# EAGLE design bare_bones_arduino (EAGLE 7.2.0)
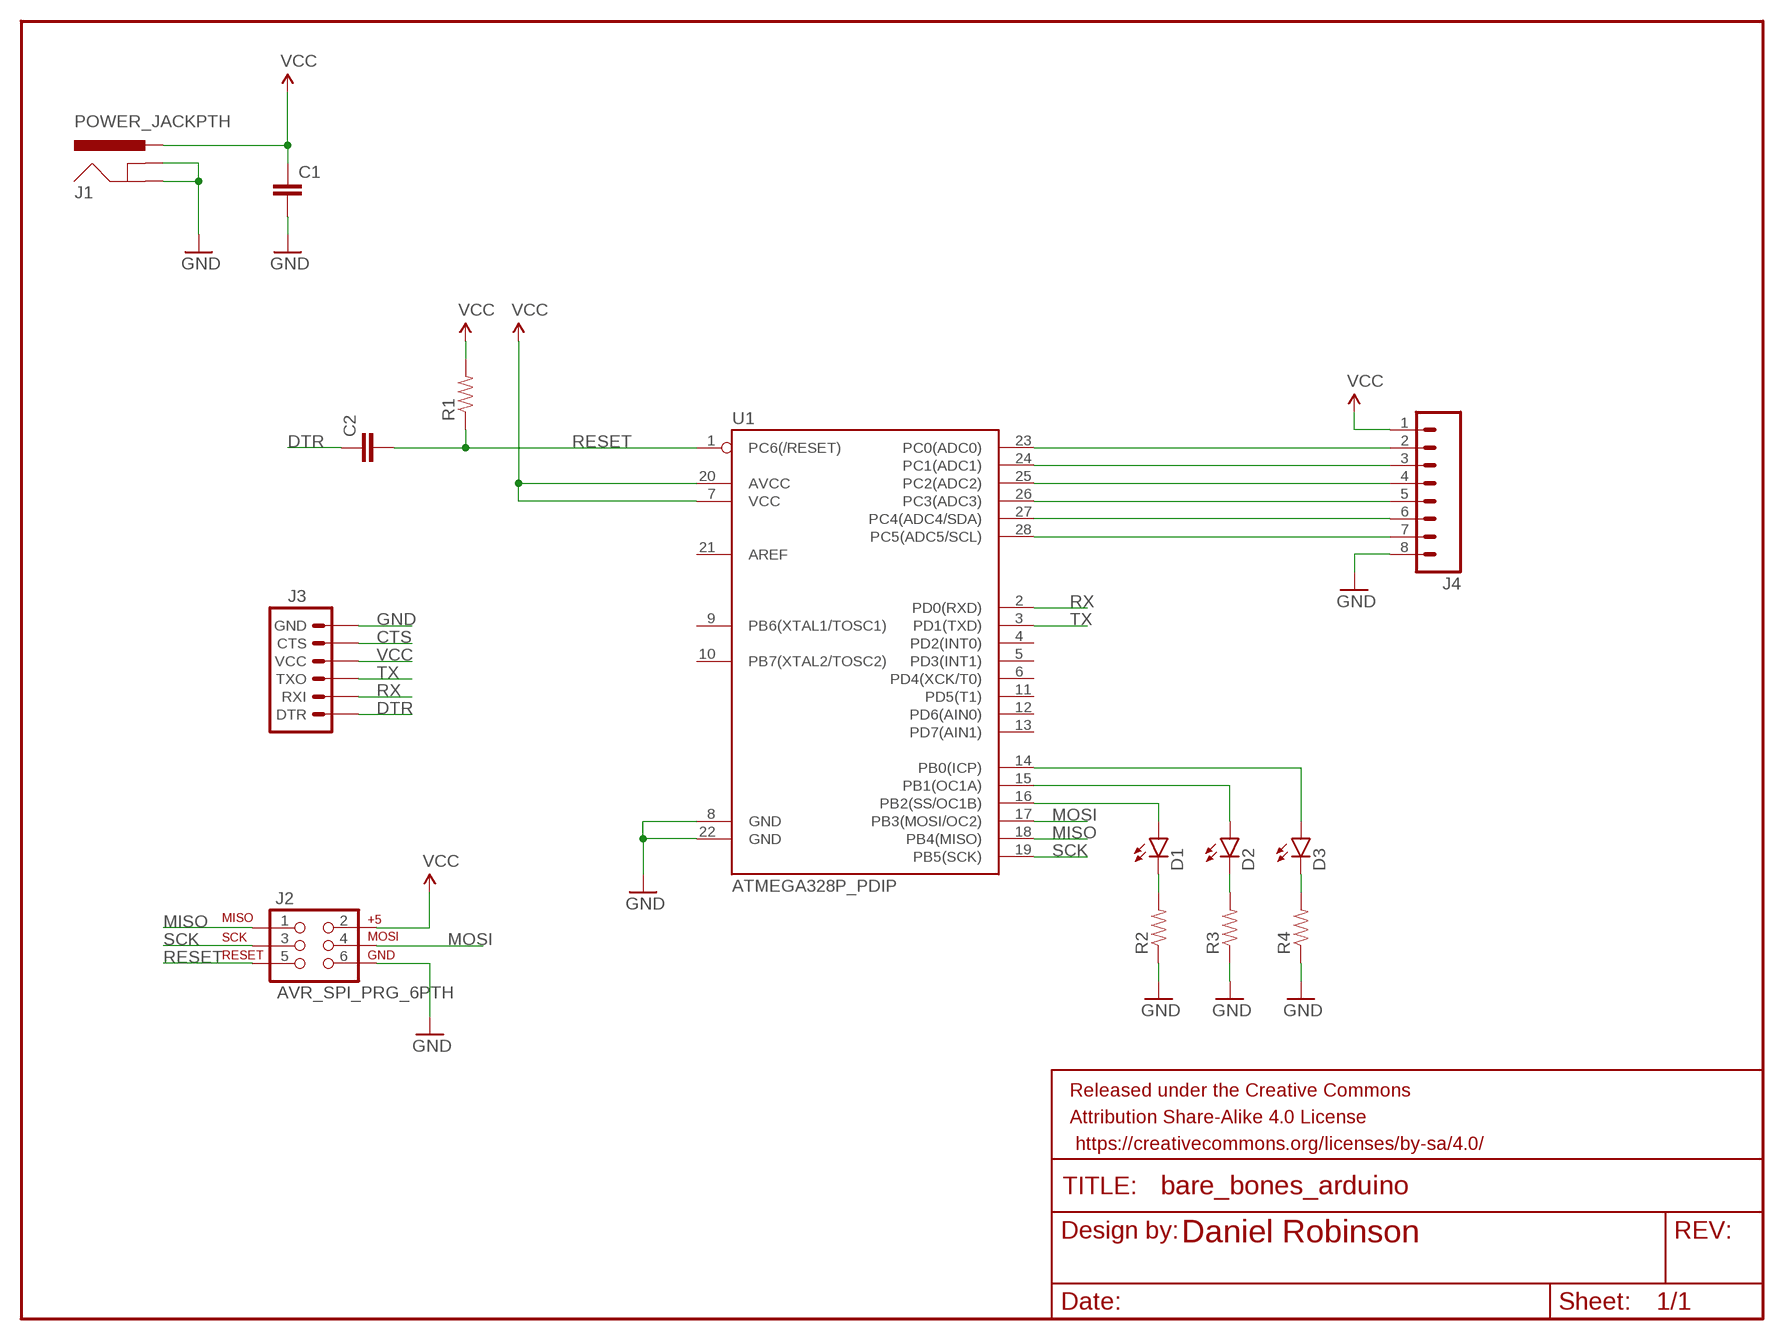
[diagram p0: schematic, sheet 1]

## Parts
C1  CAPPTH  [CAP-PTH-SMALL]
C2  CAPPTH  [CAP-PTH-SMALL]
D1  LED5MM  [LED5MM]
D2  LED5MM  [LED5MM]
D3  LED5MM  [LED5MM]
FRAME1  FRAME-LETTER  [CREATIVE_COMMONS]
J1  POWER_JACKPTH  [POWER_JACK_PTH]
J2  AVR_SPI_PRG_6PTH  [2X3]
J3  ARDUINO_SERIAL_PROGRAMPTH  [1X06]
J4  M08SILK_FEMALE_PTH  [1X08]
R1  RESISTORPTH-1/4W  [AXIAL-0.4]
R2  RESISTORPTH-1/4W  [AXIAL-0.4]
R3  RESISTORPTH-1/4W  [AXIAL-0.4]
R4  RESISTORPTH-1/4W  [AXIAL-0.4]
U1  ATMEGA328P_PDIP  [DIL28-3]

## Nets
CTS: J3.5(CTS)
DTR: C2.1 J3.1(DTR)
GND: C1.2 J1.GND J1.GNDBREAK J2.6 J3.6(GND) J4.8 R2.P$1 R3.P$1 R4.P$1 U1.8(GND) U1.22(GND)
MISO: J2.1 U1.18(PB4(MISO))
MOSI: J2.4 U1.17(PB3(MOSI/OC2))
N$1: J4.2 U1.23(PC0(ADC0))
N$3: J4.5 U1.26(PC3(ADC3))
N$4: J4.6 U1.27(PC4(ADC4/SDA))
N$5: J4.3 U1.24(PC1(ADC1))
N$6: J4.4 U1.25(PC2(ADC2))
N$7: J4.7 U1.28(PC5(ADC5/SCL))
N$9: D1.A U1.16(PB2(SS/OC1B))
N$10: D1.K(C) R2.P$2
N$11: D2.K(C) R3.P$2
N$12: D2.A U1.15(PB1(OC1A))
N$13: D3.A U1.14(PB0(ICP))
N$14: D3.K(C) R4.P$2
RESET: C2.2 J2.5 R1.P$1 U1.1(PC6(/RESET))
RX: J3.2(RXI) U1.2(PD0(RXD))
SCK: J2.3 U1.19(PB5(SCK))
TX: J3.3(TXO) U1.3(PD1(TXD))
VCC: C1.1 J1.PWR J2.2 J3.4(VCC) J4.1 R1.P$2 U1.7(VCC) U1.20(AVCC)
Unconnected: U1.4(PD2(INT0)) U1.5(PD3(INT1)) U1.6(PD4(XCK/T0)) U1.9(PB6(XTAL1/TOSC1)) U1.10(PB7(XTAL2/TOSC2)) U1.11(PD5(T1)) U1.12(PD6(AIN0)) U1.13(PD7(AIN1)) U1.21(AREF)

## Notes on the sheet
- Daniel Robinson

## Library data of the parts
C1 = SparkFun-Passives:CAP: Capacitor Standard 0603 ceramic capacitor, and 0.1" leaded capacitor.
C2 = SparkFun-Capacitors:CAP: Capacitor Standard 0603 ceramic capacitor, and 0.1" leaded capacitor.
D1-D3 = SparkFun-LED:LED: LEDs Standard schematic elements and footprints for 5mm, 3mm, 1206, and 0603 sized LEDs. 5mm - Spark Fun Electronics SKU : COM-00529 (and others)
FRAME1 = SparkFun-Aesthetics:FRAME-LETTER: Schematic Frame Standard 8.5x11 US Letter frame
J1 = SparkFun-Connectors:POWER_JACK: Power Jack This is the standard 5.5mm barrel jack for power. The PTH is the most common, proven, reliable, footprint. The Slot footprint only works if the mill layer is transmitted to the PCB fab house so be warned. Mating wall wart : TOL-00298 (and others); PROD_ID: CONN-08197
J2 = SparkFun-Connectors:AVR_SPI_PRG_6: AVR ISP 6 Pin This is the reduced ISP connector for AVR programming. Common on Arduino. This footprint will take up less PCB space and can be used with a 10-pin to 6-pin adapter such as SKU: BOB-08508 **Special note about "TEST_POINT" package. The stop mask is on the top side, so if you want your programming test points to be on the bottom of your board, make sure to place this package on the bottom side of the board. This also ensure that the orientation to program from the bottom side will be correct.
J3 = SparkFun-Connectors:ARDUINO_SERIAL_PROGRAM: FTDI connector footprints
J4 = SparkFun-Connectors:M08: Header 8 Standard 8-pin 0.1" header. Use with straight break away headers (SKU : PRT-00116), right angle break away headers (PRT-00553), swiss pins (PRT-00743), machine pins (PRT-00117), and female headers (PRT-00115).; PROD_ID: CONN-08438
R1-R4 = SparkFun-Resistors:RESISTOR: Resistor Basic schematic elements and footprints for 0603, 1206, and PTH resistors.
U1 = SparkFun-DigitalIC:ATMEGA328P_PDIP: uC used in the Arduino 32kb flash, 1k EEPROM, 2k SRAM This is the through-hole version of this chip.

## Board
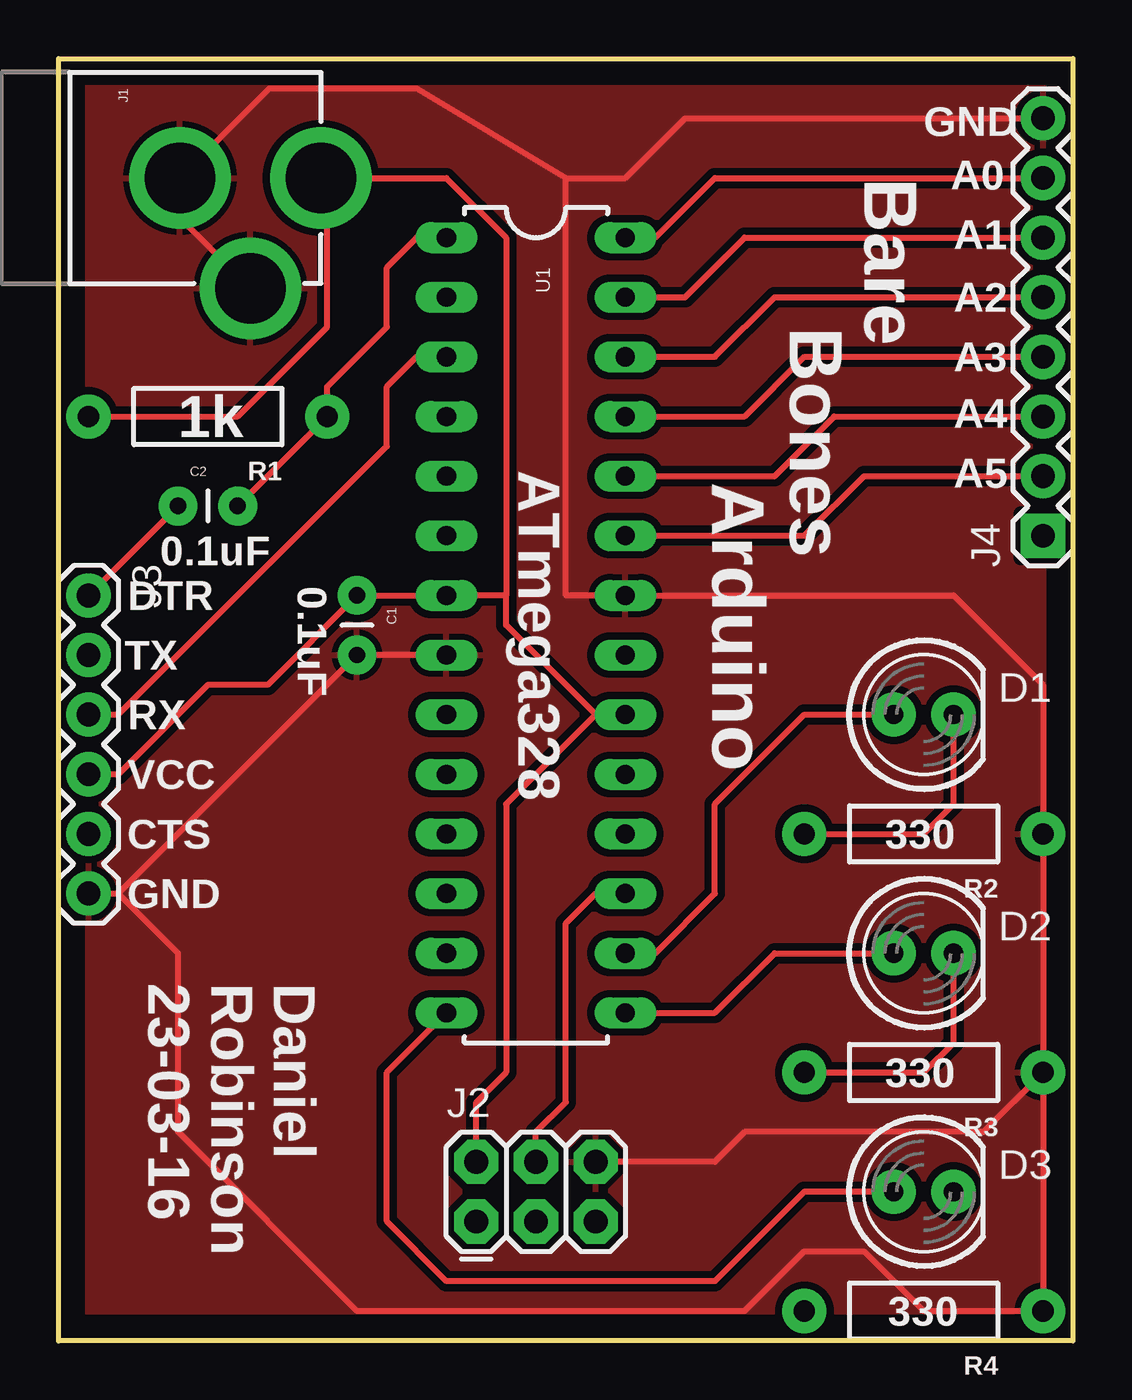
[diagram p1: board, top side]
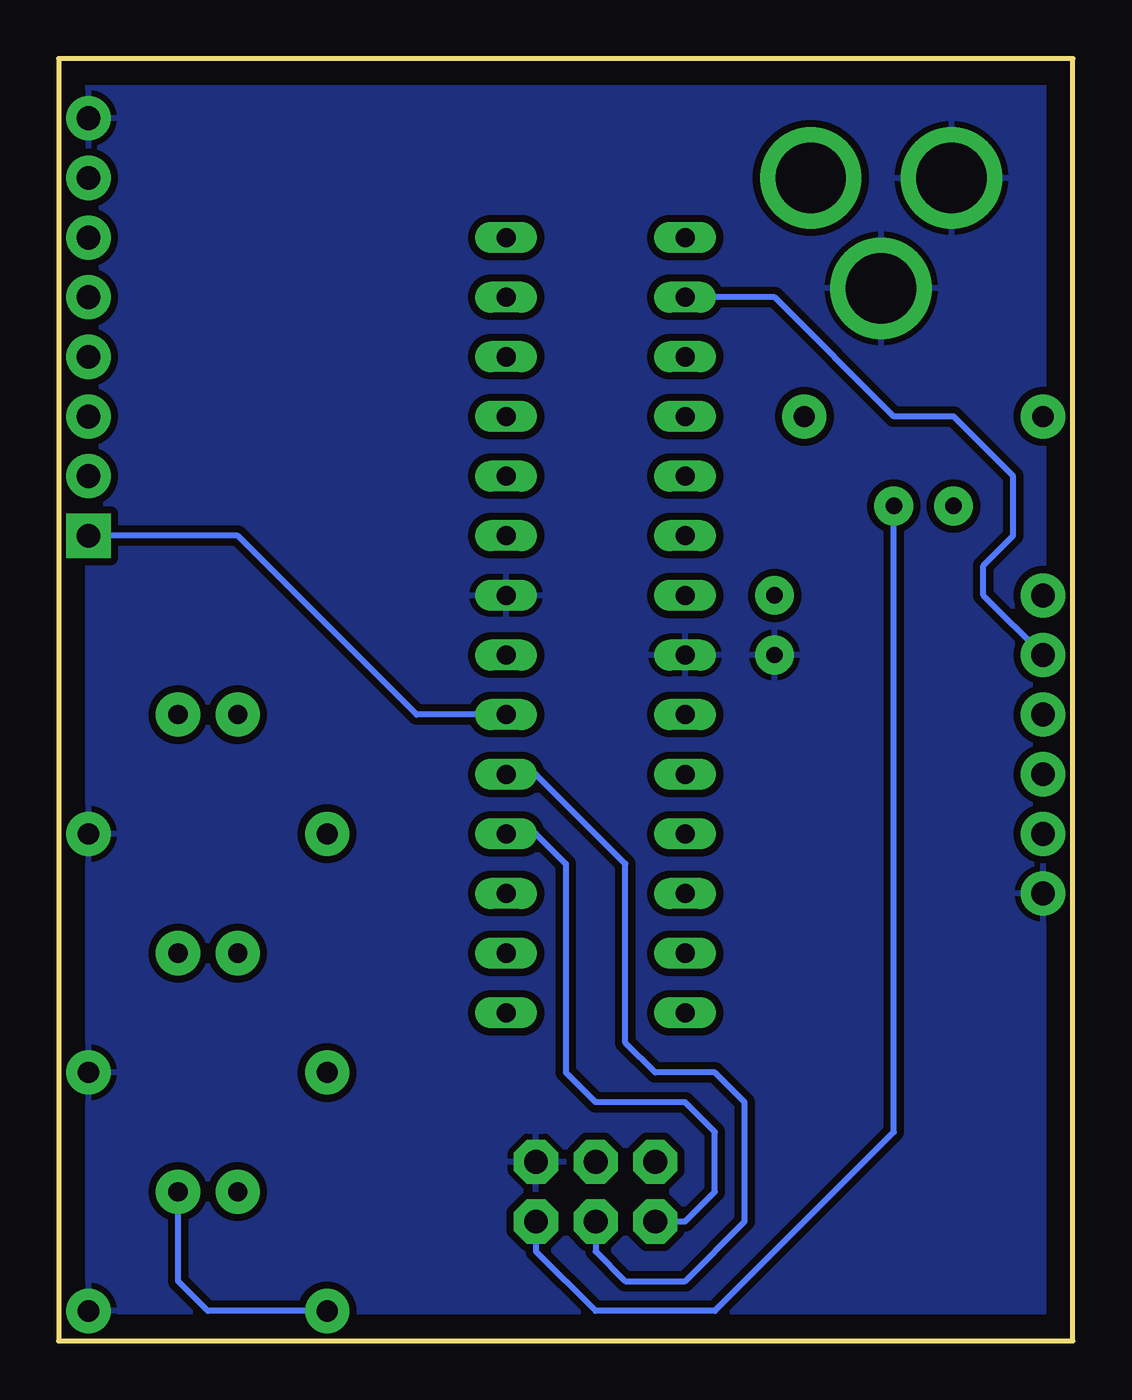
[diagram p2: board, bottom side, seen from below]

Size 43.18 x 54.61 mm. Coordinates in mm from the lower left corner, seen from the top.
Outline: 43.18,0 0,0 0,54.61 43.18,54.61 43.18,0
Copper layers (1*16): Top 0.035mm / dielectric 1.5mm / Bottom 0.035mm
Design rules "default": minimum track width 10mil, minimum drill 24mil, track to track 8mil, track to pad 8mil, pad to pad 8mil, via to via 8mil, smd to smd 8mil, copper to edge 40mil, drill to drill 8mil, minimum pad ring 10mil, minimum via ring 8mil, stop-mask expansion 4mil, vias tented up to drill 0mil, thermal gap 10mil

### Footprints (pad centres in the part's own frame; a part is rotated, then mirrored left to right if it is on the bottom)
CAP-PTH-SMALL = drill 0.7 pad 1.651: 1 0,0; 2 2.54,0
LED5MM = drill 0.813 pad 1.88: A -1.27,0; K 1.27,0
POWER_JACK_PTH = drill 2.997 pad 4.318: GND 0,7.7; GNDBREAK 4.7,10.7; PWR 0,13.7
2X3 = drill 1.016 pad 1.88 octagon: 1 0,0; 2 0,2.54; 3 2.54,0; 4 2.54,2.54; 5 5.08,0; 6 5.08,2.54
1X06 = drill 1.016 pad 1.88: 1 0,0; 2 2.54,0; 3 5.08,0; 4 7.62,0; 5 10.16,0; 6 12.7,0
1X08 = drill 1.016 pad 1.88 square: 1 0,0 | drill 1.016 pad 1.88: 2 2.54,0; 3 5.08,0; 4 7.62,0; 5 10.16,0; 6 12.7,0; 7 15.24,0; 8 17.78,0
AXIAL-0.4 = drill 0.9 pad 1.88: P$1 -5.08,0; P$2 5.08,0
DIL28-3 = drill 0.813 long: 1 -16.51,-3.81; 2 -13.97,-3.81; 3 -11.43,-3.81; 4 -8.89,-3.81; 5 -6.35,-3.81; 6 -3.81,-3.81; 7 -1.27,-3.81; 8 1.27,-3.81; 9 3.81,-3.81; 10 6.35,-3.81; 11 8.89,-3.81; 12 11.43,-3.81; 13 13.97,-3.81; 14 16.51,-3.81; 15 16.51,3.81; 16 13.97,3.81; 17 11.43,3.81; 18 8.89,3.81; 19 6.35,3.81; 20 3.81,3.81; 21 1.27,3.81; 22 -1.27,3.81; 23 -3.81,3.81; 24 -6.35,3.81; 25 -8.89,3.81; 26 -11.43,3.81; 27 -13.97,3.81; 28 -16.51,3.81

### Placement (x,y rotation side)
C1  12.7,31.75 270 top
C2  5.08,35.56 0 top
D1  36.83,26.67 0 top
D2  36.83,16.51 0 top
D3  36.83,6.35 0 top
FRAME1  17.78,-10.16 0 top  (outside the outline)
J1  -2.54,49.53 270 top
J2  17.78,5.08 0 top
J3  1.27,31.75 270 top
J4  41.91,34.29 90 top
R1  6.35,39.37 180 top
R2  36.83,21.59 180 top
R3  36.83,11.43 180 top
R4  36.83,1.27 180 top
U1  20.32,30.48 270 top

### Tracks (layer width: path | path; a pad name or v marks a point on that pad's centre or on a via)
DTR
  Top 0.254: C2.1 J3.1
GND
  Top 0.254: J1.GNDBREAK 5.16,47.83 J1.GND 8.97,53.34 15.24,53.34 21.59,49.53 | R3.P$1 R2.P$1 41.91,27.94 38.1,31.75 U1.22 21.59,31.75 21.59,49.53 | R3.P$1 R4.P$1 36.83,1.27 34.29,3.81 31.75,3.81 29.21,1.27 12.7,1.27 5.08,8.89 5.08,16.51 2.54,19.05 | 21.59,49.53 24.13,49.53 26.67,52.07 J4.8 | R3.P$1 39.37,8.89 29.21,8.89 27.94,7.62 J2.6 | U1.8 C1.2 2.54,19.05 | J3.6 2.54,19.05
  pour Top (isolate 0.305): 0,54.61 43.18,54.61 43.18,0 0,0
  pour Bottom (isolate 0.305): 0,0 0,54.61 43.18,54.61 43.18,0
MISO
  Bottom 0.254: J2.1 16.51,5.08 15.24,6.35 15.24,8.89 16.51,10.16 20.32,10.16 21.59,11.43 21.59,20.32 22.86,21.59 U1.18
MOSI
  Top 0.254: J2.4 20.32,8.89 21.59,10.16 21.59,17.78 22.86,19.05 U1.17
N$1
  Top 0.254: U1.23 31.75,34.29 34.29,36.83 J4.2
N$3
  Top 0.254: U1.26 27.94,41.91 30.48,44.45 J4.5
N$4
  Top 0.254: U1.27 26.67,44.45 29.21,46.99 J4.6
N$5
  Top 0.254: U1.24 30.48,36.83 33.02,39.37 J4.3
N$6
  Top 0.254: U1.25 29.21,39.37 31.75,41.91 J4.4
N$7
  Top 0.254: U1.28 25.4,46.99 27.94,49.53 J4.7
N$9
  Top 0.254: D1.A 31.75,26.67 27.94,22.86 27.94,19.05 25.4,16.51 U1.16
N$10
  Top 0.254: R2.P$2 36.83,21.59 38.1,22.86 D1.K
N$11
  Top 0.254: R3.P$2 36.83,11.43 38.1,12.7 D2.K
N$12
  Top 0.254: U1.15 27.94,13.97 30.48,16.51 D2.A
N$13
  Top 0.254: D3.A 31.75,6.35 27.94,2.54 16.51,2.54 13.97,5.08 13.97,11.43 U1.14
N$14
  Bottom 0.254: R4.P$2 36.83,1.27 38.1,2.54 D3.K
RESET
  Top 0.254: C2.2 R1.P$1 11.43,40.64 13.97,43.18 13.97,45.72 15.24,46.99 U1.1
  Bottom 0.254: J2.5 22.86,3.81 20.32,1.27 15.24,1.27 7.62,8.89 C2.2
RX
  Bottom 0.254: J3.2 3.81,31.75 3.81,33.02 2.54,34.29 2.54,36.83 5.08,39.37 7.62,39.37 12.7,44.45 U1.2
SCK
  Bottom 0.254: J2.3 20.32,3.81 19.05,2.54 16.51,2.54 13.97,5.08 13.97,10.16 15.24,11.43 17.78,11.43 19.05,12.7 19.05,20.32 22.86,24.13 U1.19
TX
  Top 0.254: U1.3 15.24,41.91 13.97,40.64 13.97,38.1 2.54,26.67 J3.3
VCC
  Top 0.254: 19.05,31.75 19.05,46.99 16.51,49.53 J1.PWR 11.43,49.26 11.43,43.18 7.62,39.37 R1.P$2 | 19.05,31.75 U1.7 C1.1 8.89,27.94 6.35,27.94 2.54,24.13 J3.4 | J2.2 17.78,10.16 19.05,11.43 19.05,22.86 22.86,26.67 | 22.86,26.67 19.05,30.48 19.05,31.75 | U1.20 22.86,26.67
  Bottom 0.254: U1.20 27.94,26.67 35.56,34.29 J4.1

### Text on the board
tPlace: GND | Bare | A0 | A1 | Bones | A2 | A3 | 1k | A4 | ATmega328 | Arduino | A5 | 0.1uF | DTR | TX | 0.1uF | RX | VCC | CTS | 330 | GND | Daniel / Robinson / 23-03-16 | 330 | 330